# Altium schematic sheet Sensor Infra.SchDoc
size A4; SheetNumber: 3; SheetTotal: 4
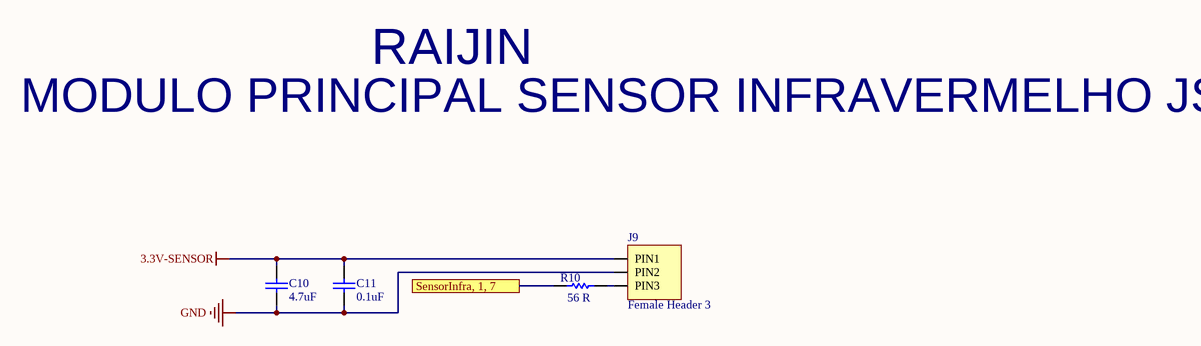
[diagram p0: Sensor Infra.SchDoc]

## Parts
C10  4.7uF  [C0805]
C11  0.1uF  [C0805]
J9  Female Header 3  [FEMALE HEADER 3]
R10  56 R  [RESISTOR_0603]

## Ports
SensorInfra, 1, 7

## Nets
3.3V-SENSOR: C10.2 C11.2 J9.PIN1
GND: C10.1 C11.1 J9.PIN2
SensorInfra, 1, 7: R10.1 ; port SensorInfra, 1, 7
NetJ9_PIN3: J9.PIN3 R10.2

## Notes on the sheet
- RAIJIN
- MODULO PRINCIPAL SENSOR INFRAVERMELHO JS40F

## Library data of the parts
C10 = 0805X475M250CT: CAP CER 4.7uF 25V 20% 0805; Manufacturer: Walsin; Dieletric: X5R; Library Control - Checked Footprint: No; Library Control - Checked Schematic: Yes; Library Control - Person that Checked Schematic: Guilherme; Library Control - Person that did the Last Update Schematic: Marcos; Supplier 1: Mouser; Part Number: 0805X475M250CT; Category: Ceramic Capacitor; Price: 1=0,26 10=0,178 100=0,101 1000=0,064 (USD); Supplier Part Number 1: 791-0805X475M250CT; Library Ref: Capacitor; Operating Temperature: -55°C ~ 85°C; Package / Case: 0805(2012 metric); Size / Dimension: 2 mm L x 1.25 mm W x 0.8 mm H; Tolerance: 20%; Value: 4.7uF; Voltage - Rated: 25V; ESR: -; Library Control - Last Update: 26/06/2021 19:59; ComponentLink1Description: Datasheet; ComponentLink1URL: https://br.mouser.com/datasheet/2/210/WTC_MLCC_General_Purpose-1534899.pdf; ComponentLink2Description: Mouser Link; ComponentLink2URL: https://br.mouser.com/ProductDetail/Walsin/0805X475M250CT?qs=%2Fha2pyFadugovbtJ4IPO2aI5%2FHfN6czWOLxzJ368rfolfgZFQZPK8JJR9MicoCMy
C11 = 08053C104KAT2A: CAP CER 0.1uF 25V X7R 0805; Manufacturer: AVX; Tolerance: 10%; ESR: 0.05; Library Control - Checked Footprint: Yes; Library Control - Person that Checked Footprint: Nikaum; Supplier 1: Mouser; Part Number: 08053C104KAT2A; Category: Ceramic Capacitor; Price: 1=0,14, 10=0,069, 100=0,038 (USD); Supplier Part Number 1: 581-08053C104K; Library Ref: Capacitor; Operating Temperature: -55 C ~ 125 C; Package / Case: 0805 (2012 metric); Size / Dimension: 2,00 L x 1,20 W x 0,50 H; Value: 0.1uF; Voltage - Rated: 25V; Dieletric: X7R; Library Control - Checked Schematic: Yes; Library Control - Last Update: 27/06/2021 23:35; Library Control - Person that Checked Schematic: Nikaum; Library Control - Person that did the Last Update Footprint: Nikaum; Library Control - Person that did the Last Update Schematic: Nikaum; ComponentLink1Description: Datasheet; ComponentLink1URL: https://br.mouser.com/datasheet/2/40/X7RDielectric-777024.pdf; ComponentLink2Description: Mouser Link; ComponentLink2URL: https://br.mouser.com/ProductDetail/AVX/08053C104KAT2A?qs=EihRZLdKnF2GcTBzDkE%2FiQ%3D%3D
J9 = Female Header 3: Number of Contacts: 3; System: Connector; Library Ref: Header
R10 = CR0603-FX-56R0ELF: RES SMD 56 OHMS 1% 1/10W 0603; Manufacturer: Bourns; Temperature Coefficient: 100 PPM / C; Power Rating: 100 mW (1/10 W); Voltage Rating: 50 V; Library Control - Checked Footprint: Yes; Library Control - Person that Checked Footprint: Nikaum; Library Control - Person that did the Last Update Footprint: Nicolas; Supplier 1: Mouser; Part Number: CR0603-FX-56R0ELF; Category: Thick Film Resistors - SMD; Price: 1=0,10, 10=0,019, 100=0,011(USD); Package / Case: 0603 (1608 Metric); Operating Temperature: - 55°C ~ 155°C; Value: 56 R; Tolerance: 1 %; Library Ref: Resistor; Resistor Type: Fixo; Size / Dimension: 1,60 L x 0,80 W x 0,45 H; Supplier Part Number 1: 652-CR0603FX-56R0ELF; Library Control - Checked Schematic: Yes; Library Control - Last Update: 27/06/2021 20:52; Library Control - Person that Checked Schematic: Nikaum; Library Control - Person that did the Last Update Schematic: Nikaum; ComponentLink1Description: Mouser Link; ComponentLink1URL: https://br.mouser.com/ProductDetail/Bourns/CR0603-FX-56R0ELF?qs=0nF2VnfAjXkVwSNglvrNkw%3D%3D; ComponentLink2Description: Datasheet; ComponentLink2URL: https://br.mouser.com/datasheet/2/54/crxxxxx-1858361.pdf